# Altium schematic sheet 2015-08-14_11-35-571.schdoc
size 628 x 193 mm; SheetNumber: 1; SheetTotal: 1
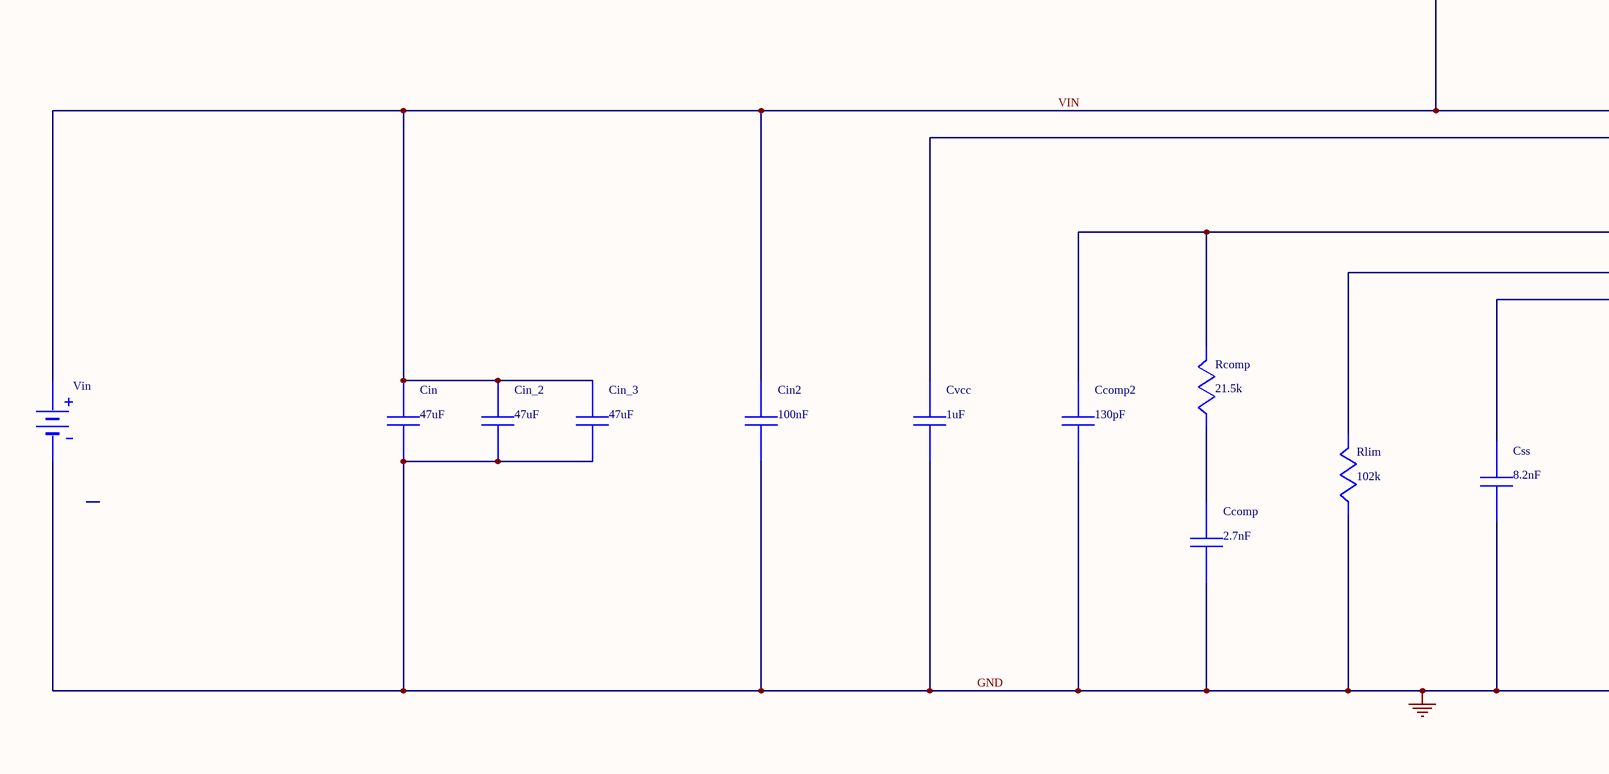
[diagram p0: 2015-08-14_11-35-571.schdoc, left]
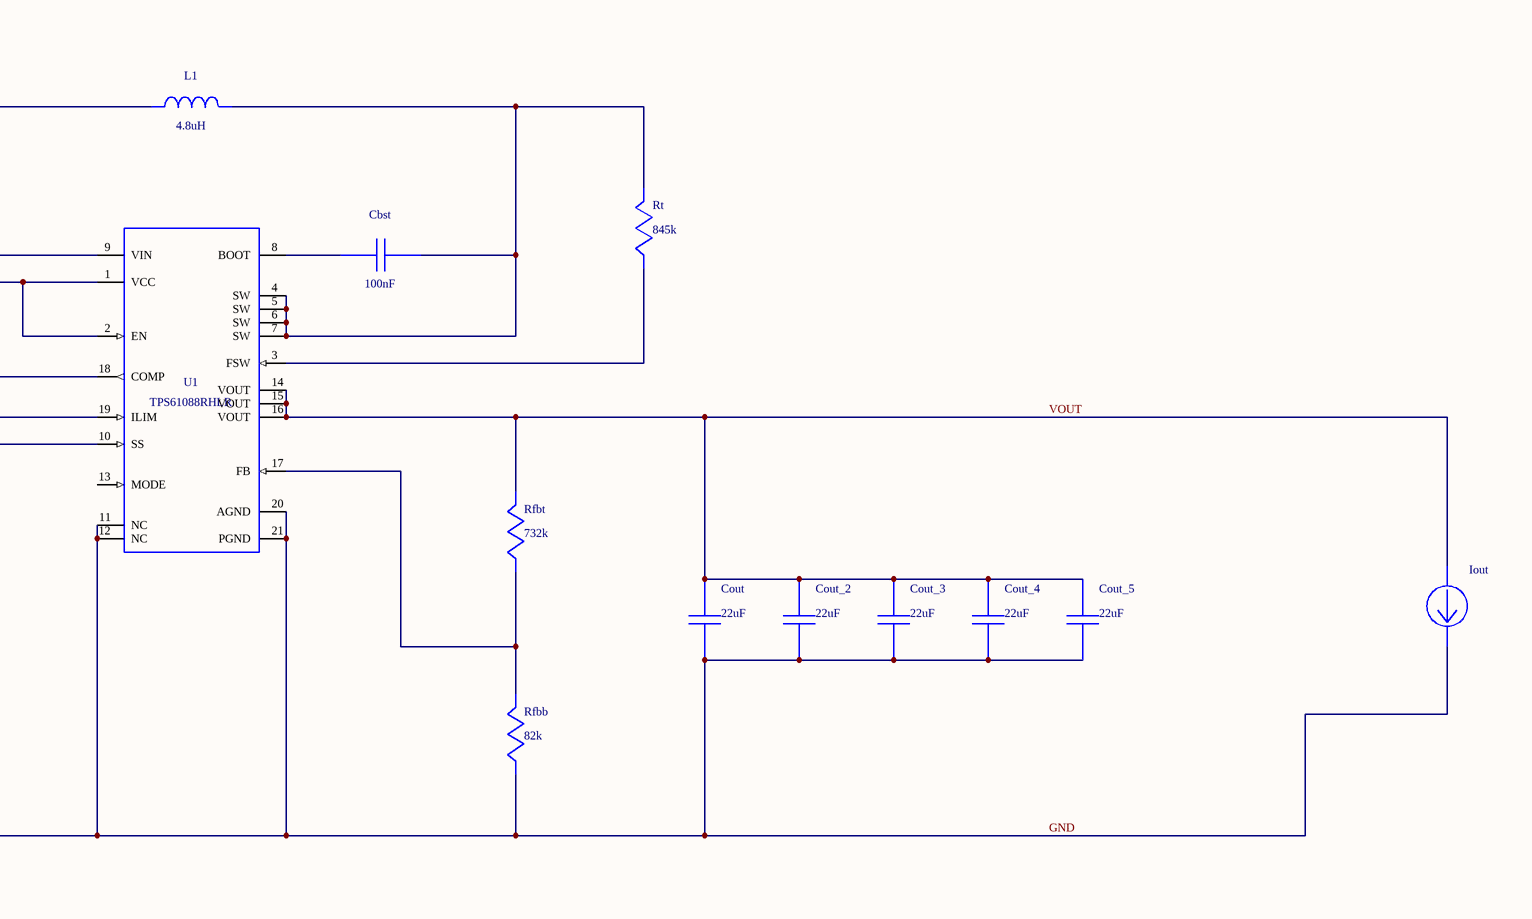
[diagram p1: 2015-08-14_11-35-571.schdoc, right]

## Parts
Cbst  value 100nF  (hidden comment: 08053C104KAT2A)
Ccomp  value 2.7nF  (hidden comment: CC0805KRX7R9BB272)
Ccomp2  value 130pF  (hidden comment: CL21C131JBANNNC)
Cin  value 47uF  (hidden comment: GRM32ER61C476ME15L)
Cin2  value 100nF  (hidden comment: GRM155R61C104KA88D)
Cin_2  value 47uF  (hidden comment: GRM32ER61C476ME15L)
Cin_3  value 47uF  (hidden comment: GRM32ER61C476ME15L)
Cout  value 22uF  (hidden comment: GRM32ER61E226KE15L)
Cout_2  value 22uF  (hidden comment: GRM32ER61E226KE15L)
Cout_3  value 22uF  (hidden comment: GRM32ER61E226KE15L)
Cout_4  value 22uF  (hidden comment: GRM32ER61E226KE15L)
Cout_5  value 22uF  (hidden comment: GRM32ER61E226KE15L)
Css  value 8.2nF  (hidden comment: GRM155R71C822KA01D)
Cvcc  value 1uF  (hidden comment: C1608X5R1A105K)
Iout  WB_CURRENT_LOAD  (value not drawn)
L1  value 4.8uH  (hidden comment: ETQPAF4R8HFA)
Rcomp  value 21.5k  (hidden comment: ERJ-6ENF2152V)
Rfbb  value 82k  (hidden comment: RR1220P-823-D)
Rfbt  value 732k  (hidden comment: CRCW0402732KFKED)
Rlim  value 102k  (hidden comment: ERJ-8ENF1023V)
Rt  value 845k  (hidden comment: ERJ-8ENF8453V)
U1  TPS61088RHLR
Vin  WB_BATTERY  (value not drawn)

## Nets
GND: Ccomp.2 Ccomp2.2 Cin.2 Cin2.2 Cin_2.2 Cin_3.2 Cout.2 Cout_2.2 Cout_3.2 Cout_4.2 Cout_5.2 Css.2 Cvcc.2 Iout.2(-) Rfbb.2 Rlim.2 U1.11(NC) U1.12(NC) U1.20(AGND) U1.21(PGND) Vin.2(-)  [also labelled 0]
VIN: Cin.1 Cin2.1 Cin_2.1 Cin_3.1 L1.1 U1.9(VIN) Vin.1(+)
VOUT: Cout.1 Cout_2.1 Cout_3.1 Cout_4.1 Cout_5.1 Iout.1(+) Rfbt.1 U1.14(VOUT) U1.15(VOUT) U1.16(VOUT)
NetCbst_1: Cbst.1 U1.8(BOOT)
NetCbst_2: Cbst.2 L1.2 Rt.1 U1.4(SW) U1.5(SW) U1.6(SW) U1.7(SW)
NetCcomp2_1: Ccomp2.1 Rcomp.1 U1.18(COMP)
NetCcomp_1: Ccomp.1 Rcomp.2
NetCss_1: Css.1 U1.10(SS)
NetCvcc_1: Cvcc.1 U1.1(VCC) U1.2(EN)
NetRfbb_1: Rfbb.1 Rfbt.2 U1.17(FB)
NetRlim_1: Rlim.1 U1.19(ILIM)
NetRt_2: Rt.2 U1.3(FSW)

Not connected (* = marked no-connect by the designer): U1 13(MODE)

## Library data of the parts
Cbst = 08053C104KAT2A: Manufacturer Name: AVX; PackageReference: 08053C104KAT2A; Manufacturer Part Number: 08053C104KAT2A
Ccomp = CC0805KRX7R9BB272: CC0805KRX7R9BB27; Manufacturer Name: Yageo America; PackageReference: CC0805KRX7R9BB272; Manufacturer Part Number: CC0805KRX7R9BB272
Ccomp2 = CL21C131JBANNNC: Manufacturer Name: Samsung Electro-Mechanics; PackageReference: CL21C131JBANNNC; Manufacturer Part Number: CL21C131JBANNNC
Cin Cin_2 Cin_3 = GRM32ER61C476ME15L: GRM32ER61C476ME1; Manufacturer Name: MuRata; PackageReference: GRM32ER61C476ME15L; Manufacturer Part Number: GRM32ER61C476ME15L
Cin2 = GRM155R61C104KA88D: GRM155R61C104KA8; Manufacturer Name: MuRata; PackageReference: GRM155R61C104KA88D; Manufacturer Part Number: GRM155R61C104KA88D
Cout Cout_2-Cout_5 = GRM32ER61E226KE15L: GRM32ER61E226KE1; Manufacturer Name: MuRata; PackageReference: GRM32ER61E226KE15L; Manufacturer Part Number: GRM32ER61E226KE15L
Css = GRM155R71C822KA01D: GRM155R71C822KA0; Manufacturer Name: MuRata; PackageReference: GRM155R71C822KA01D; Manufacturer Part Number: GRM155R71C822KA01D
Cvcc = C1608X5R1A105K: Manufacturer Name: TDK; PackageReference: C1608X5R1A105K; Manufacturer Part Number: C1608X5R1A105K
Iout = WB_CURRENT_LOAD: Value: UNLISTED; PackageReference: WB_CURRENT_LOAD; Manufacturer Part Number: WB_CURRENT_LOAD; Manufacturer Name: WB_CURRENT_LOAD
L1 = ETQPAF4R8HFA: Manufacturer Name: Panasonic; PackageReference: ETQPAF4R8HFA; Manufacturer Part Number: ETQPAF4R8HFA
Rcomp = ERJ-6ENF2152V: Manufacturer Name: Panasonic; PackageReference: ERJ-6ENF2152V; Manufacturer Part Number: ERJ-6ENF2152V
Rfbb = RR1220P-823-D: Manufacturer Name: Susumu Co Ltd; PackageReference: RR1220P-823-D; Manufacturer Part Number: RR1220P-823-D
Rfbt = CRCW0402732KFKED: Manufacturer Name: Vishay-Dale; PackageReference: CRCW0402732KFKED; Manufacturer Part Number: CRCW0402732KFKED
Rlim = ERJ-8ENF1023V: Manufacturer Name: Panasonic; PackageReference: ERJ-8ENF1023V; Manufacturer Part Number: ERJ-8ENF1023V
Rt = ERJ-8ENF8453V: Manufacturer Name: Panasonic; PackageReference: ERJ-8ENF8453V; Manufacturer Part Number: ERJ-8ENF8453V
U1 = TPS61088RHLR: Manufacturer Name: Texas Instruments; Value: UNLISTED; PackageReference: TPS61088RHLR; Manufacturer Part Number: TPS61088RHLR
Vin = WB_BATTERY: Value: UNLISTED; PackageReference: WB_BATTERY; Manufacturer Part Number: WB_BATTERY; Manufacturer Name: WB_BATTERY